# Altium schematic sheet Motions.SchDoc
size A4; SheetNumber: 3; SheetTotal: 4
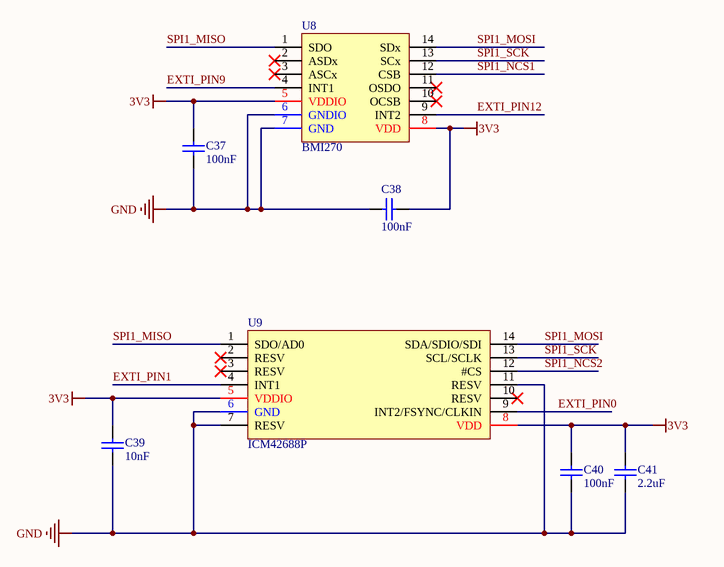
[diagram p0: Motions.SchDoc]

## Parts
C37  100nF  [C0402_NS]
C38  100nF  [C0402_NS]
C39  10nF  [C0402_NS]
C40  100nF  [C0402_NS]
C41  2.2uF  [C0402_NS]
U8  BMI270  [LGA-14]
U9  ICM42688P  [LGA-14]

## Nets
3V3: C37.2 C38.2 C39.2 C40.2 C41.2 U8.5(VDDIO) U8.8(VDD) U9.5(VDDIO) U9.8(VDD)
GND: C37.1 C38.1 C39.1 C40.1 C41.1 U8.6(GNDIO) U8.7(GND) U9.6(GND) U9.7(RESV) U9.11(RESV)
EXTI_PIN0: U9.9(INT2/FSYNC/CLKIN)
EXTI_PIN1: U9.4(INT1)
EXTI_PIN9: U8.4(INT1)
EXTI_PIN12: U8.9(INT2)
SPI1_MISO: U8.1(SDO) U9.1(SDO/AD0)
SPI1_MOSI: U8.14(SDx) U9.14(SDA/SDIO/SDI)
SPI1_NCS1: U8.12(CSB)
SPI1_NCS2: U9.12(#CS)
SPI1_SCK: U8.13(SCx) U9.13(SCL/SCLK)

Not connected (* = marked no-connect by the designer): U8 2(ASDx)* 3(ASCx)* 10(OCSB)* 11(OSDO)*; U9 2(RESV)* 3(RESV)* 10(RESV)*

## Library data of the parts
C37-C41 = C0402: Capacitance 0402
U8 = BMI270: 6-axis, smart, low power Inertial Measurement Unit for high-performance applications
U9 = ICM42688P: TDK Invensense high-performance 6-DOF Motion Tracking MEMS